# EAGLE design CactusCon7 (EAGLE 9.1.3)
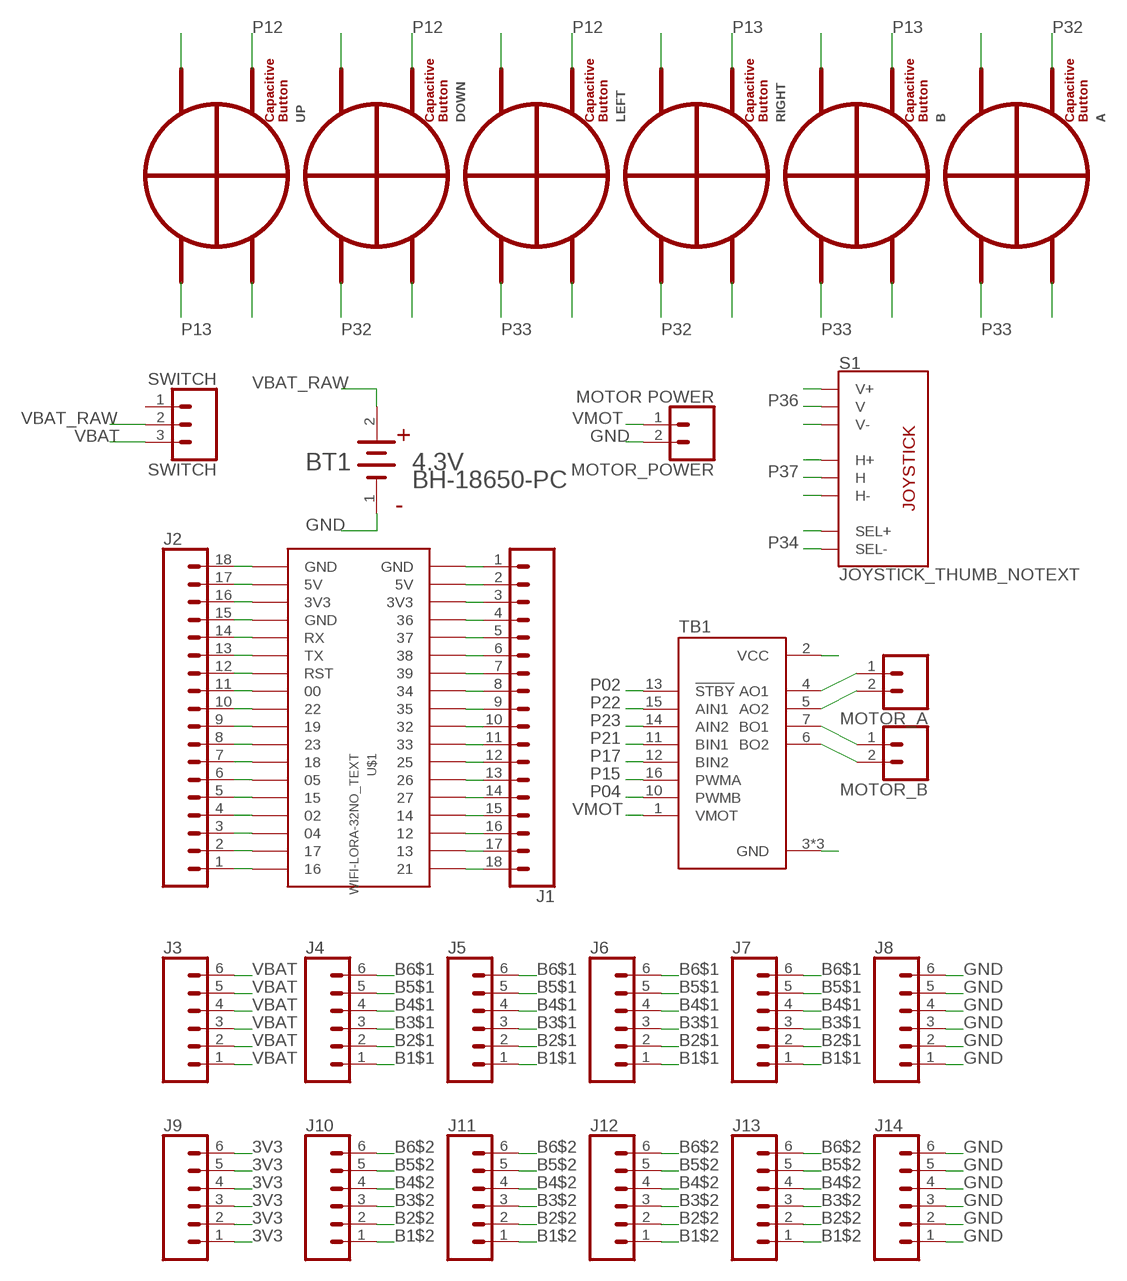
[diagram p0: schematic, sheet 1]

## Parts
A  BUTTON_ACTIVE_QUADNO-LOGO  [BUTTON_ACTIVE_QUAD_10MM_NO_LOGO]
B  BUTTON_ACTIVE_QUADNO-LOGO  [BUTTON_ACTIVE_QUAD_10MM_NO_LOGO]
BT1  MPD_BH-18650-PCMPD_BH-18650-PC_0_0  [MPD_BH-18650-PC_0]
DOWN  BUTTON_ACTIVE_QUADNO-LOGO  [BUTTON_ACTIVE_QUAD_10MM_NO_LOGO]
J1  CONN_18  [1X18]
J2  CONN_18  [1X18]
J3  CONN_06NO_SILK_FEMALE_PTH  [1X06_NO_SILK]
J4  CONN_06NO_SILK_FEMALE_PTH  [1X06_NO_SILK]
J5  CONN_06NO_SILK_FEMALE_PTH  [1X06_NO_SILK]
J6  CONN_06NO_SILK_FEMALE_PTH  [1X06_NO_SILK]
J7  CONN_06NO_SILK_FEMALE_PTH  [1X06_NO_SILK]
J8  CONN_06NO_SILK_FEMALE_PTH  [1X06_NO_SILK]
J9  CONN_06NO_SILK_FEMALE_PTH  [1X06_NO_SILK]
J10  CONN_06NO_SILK_FEMALE_PTH  [1X06_NO_SILK]
J11  CONN_06NO_SILK_FEMALE_PTH  [1X06_NO_SILK]
J12  CONN_06NO_SILK_FEMALE_PTH  [1X06_NO_SILK]
J13  CONN_06NO_SILK_FEMALE_PTH  [1X06_NO_SILK]
J14  CONN_06NO_SILK_FEMALE_PTH  [1X06_NO_SILK]
LEFT  BUTTON_ACTIVE_QUADNO-LOGO  [BUTTON_ACTIVE_QUAD_10MM_NO_LOGO]
MOTOR_A  CONN_02  [1X02]
MOTOR_B  CONN_02  [1X02]
MOTOR_POWER  MOTOR POWER  CONN_02  [1X02]
RIGHT  BUTTON_ACTIVE_QUADNO-LOGO  [BUTTON_ACTIVE_QUAD_10MM_NO_LOGO]
S1  JOYSTICK_THUMB_NOTEXT  [JOYSTICK]
SWITCH  SWITCH  CONN_03  [1X03]
TB1  POLOLU-713ROB-14451  [SHIELD_POLOLU-713]
U$1  WIFI-LORA-32NO_TEXT  [2.54MM_2X18_NO_TEXT]
UP  BUTTON_ACTIVE_QUADNO-LOGO  [BUTTON_ACTIVE_QUAD_10MM_NO_LOGO]

## Nets
3V3 [power]: J1.3 J2.16 J9.1 J9.2 J9.3 J9.4 J9.5 J9.6 S1.B1A(SEL+) S1.H1(H+) S1.V1(V+) TB1.2(VCC) U$1.P$3(3V3) U$1.P$34(3V3)
5V [power]: J1.2 J2.17 U$1.P$2(5V) U$1.P$35(5V)
AO1 [power]: MOTOR_A.1 TB1.4(AO1)
AO2 [power]: MOTOR_A.2 TB1.5(AO2)
B1$1: J4.1 J5.1 J6.1 J7.1
B1$2: J10.1 J11.1 J12.1 J13.1
B2$1: J4.2 J5.2 J6.2 J7.2
B2$2: J10.2 J11.2 J12.2 J13.2
B3$1: J4.3 J5.3 J6.3 J7.3
B3$2: J10.3 J11.3 J12.3 J13.3
B4$1: J4.4 J5.4 J6.4 J7.4
B4$2: J10.4 J11.4 J12.4 J13.4
B5$1: J4.5 J5.5 J6.5 J7.5
B5$2: J10.5 J11.5 J12.5 J13.5
B6$1: J4.6 J5.6 J6.6 J7.6
B6$2: J10.6 J11.6 J12.6 J13.6
BO1 [power]: MOTOR_B.1 TB1.7(BO1)
BO2 [power]: MOTOR_B.2 TB1.6(BO2)
GND [power]: A.Q2 A.Q4 B.Q2 B.Q4 BT1.1(CATHODE) DOWN.Q2 DOWN.Q4 J1.1 J2.15 J2.18 J8.1 J8.2 J8.3 J8.4 J8.5 J8.6 J14.1 J14.2 J14.3 J14.4 J14.5 J14.6 LEFT.Q2 LEFT.Q4 MOTOR_POWER.2 RIGHT.Q2 RIGHT.Q4 S1.H3(H-) S1.V3(V-) TB1.3(GND) TB1.8(GND) TB1.9(GND) U$1.P$1(GND) U$1.P$4(GND) U$1.P$36(GND) UP.Q2 UP.Q4
P00: J2.11 U$1.P$8
P02: J2.4 TB1.13(!STBY) U$1.P$15
P04: J2.3 TB1.10(PWMB) U$1.P$16
P05: J2.6 U$1.P$13
P12 [touch]: DOWN.Q3 J1.16 LEFT.Q3 U$1.P$21 UP.Q3
P13 [touch]: B.Q3 J1.17 RIGHT.Q3 U$1.P$20 UP.Q1
P14: J1.15 U$1.P$22
P15: J2.5 TB1.16(PWMA) U$1.P$14
P16: J2.1 U$1.P$18
P17: J2.2 TB1.12(BIN2) U$1.P$17
P18: J2.7 U$1.P$12
P19: J2.9 U$1.P$10
P21: J1.18 TB1.11(BIN1) U$1.P$19
P22: J2.10 TB1.15(AIN1) U$1.P$9
P23: J2.8 TB1.14(AIN2) U$1.P$11
P25: J1.12 U$1.P$25
P26: J1.13 U$1.P$24
P27: J1.14 U$1.P$23
P32 [touch]: A.Q3 DOWN.Q1 J1.10 RIGHT.Q1 U$1.P$27
P33 [touch]: A.Q1 B.Q1 J1.11 LEFT.Q1 U$1.P$26
P34: J1.8 S1.B2A(SEL-) U$1.P$29
P35: J1.9 U$1.P$28
P36: J1.4 S1.V2(V) U$1.P$33
P37: J1.5 S1.H2(H) U$1.P$32
P38: J1.6 U$1.P$31
P39: J1.7 U$1.P$30
RST: J2.12 U$1.P$7(RST)
RX: J2.14 U$1.P$5(RX)
TX: J2.13 U$1.P$6(TX)
VBAT [power]: J3.1 J3.2 J3.3 J3.4 J3.5 J3.6 SWITCH.3
VBAT_RAW [power]: BT1.2(ANODE) SWITCH.2
VMOT [power]: MOTOR_POWER.1 TB1.1(VMOT)
Unconnected: SWITCH.1

## Library data of the parts
A B DOWN LEFT RIGHT UP = PatternAgents-TouchWidgets:BUTTON_ACTIVE_QUAD: Button, Active Capacitive/Touch Sensing Type, Quad Source : http://www.PatternAgents.com Github : https://github.com/PatternAgents License : http://creativecommons.org/licenses/by-sa/3.1/ (Creative Commons 3.1) THIS SOFTWARE IS PROVIDED BY THE CONTRIBUTORS "AS IS" AND WITHOUT ANY EXPRESS OR IMPLIED WARRANTIES, INCLUDING, BUT NOT LIMITED TO, THE IMPLIED WARRANTIES OF MERCHANTABILITY AND FITNESS FOR A PARTICULAR PURPOSE ARE DISCLAIMED. IN NO EVENT SHALL THE COPYRIGHT OWNER OR CONTRIBUTORS BE LIABLE FOR ANY DIRECT, INDIRECT, INCIDENTAL, SPECIAL, EXEMPLARY, OR CONSEQUENTIAL DAMAGES (INCLUDING, BUT NOT LIMITED TO, PROCUREMENT OF SUBSTITUTE GOODS OR SERVICES; LOSS OF USE, DATA, OR PROFITS; OR BUSINESS INTERRUPTION) HOWEVER CAUSED AND ON ANY THEORY OF LIABILITY, WHETHER IN CONTRACT, STRICT LIABILITY, OR TORT (INCLUDING NEGLIGENCE OR OTHERWISE) ARISING IN ANY WAY OUT OF THE USE OF THIS SOFTWARE, EVEN IF ADVISED OF THE POSSIBILITY OF SUCH DAMAGE.
BT1 = MPD - BH-18650-PC:MPD_BH-18650-PC: Battery Holder 0.839" (21.31mm) Cylindrical Holder.; CENTROID_NOT_SPECIFIED: No; DATASHEET: http://www.memoryprotectiondevices.com/datasheets/BH-18650-PC-datasheet.pdf; DIGIKEY_DESCRIPTION: BATT HOLDER BATT 18650 1CELL PC PIN; DIGIKEY_PART_NUMBER: BH-18650-PC-ND; LEAD_FREE: yes; MF: MPD; MPN: BH-18650-PC; PACKAGE: PTH_BAT; PREFIX: BT; ROHS: yes; TEMPERATURE_RANGE_HIGH: +180°C; TEMPERATURE_RANGE_LOW: -40°C; VOLTAGE: 4.3V
J1 J2 = SparkFun-Connectors:CONN_18: Multi connection point. Often used as Generic Header-pin footprint for 0.1 inch spaced/style header connections On any of the 0.1 inch spaced packages, you can populate with these: Break Away Headers - Straight <https://www.sparkfun.com/products/116> (PRT-00116) Break Away Male Headers - Right Angle <https://www.sparkfun.com/products/553> (PRT-00553) Female Headers <https://www.sparkfun.com/products/115> (PRT-00115) Break Away Headers - Machine Pin <https://www.sparkfun.com/products/117> (PRT-00117) Break Away Female Headers - Swiss Machine Pin <https://www.sparkfun.com/products/743> (PRT-00743) For SCREWTERMINALS and SPRING TERMINALS visit here: Screw Terimnals on SparkFun.com <https://www.sparkfun.com/search/results?term=Screw+Terminals> (5mm/3.5mm/2.54mm spacing) This device is also useful as a general connection point to wire up your design to another part of your project. Our various solder wires solder well into these plated through hole pads. Hook-Up Wire - Assortment (Stranded, 22 AWG) <https://www.sparkfun.com/products/11375> (PRT-11375) Hook-Up Wire - Assortment (Solid Core, 22 AWG) <https://www.sparkfun.com/products/11367> (PRT-11367) View the entire wire category on our website here <https://www.sparkfun.com/categories/141> Special notes: Molex polarized connector foot print use with SKU : PRT-08231 with associated crimp pins and housings. 1MM SMD Version SKU: PRT-10208 NOTES ON THE VARIANTS LOCK and LOCK_LONGPADS... This footprint was designed to help hold the alignment of a through-hole component (i.e. 6-pin header) while soldering it into place. You may notice that each hole has been shifted either up or down by 0.005 of an inch from it's more standard position (which is a perfectly straight line). This slight alteration caused the pins (the squares in the middle) to touch the edges of the holes. Because they are alternating, it causes a "brace" to hold the component in place. 0.005 has proven to be the perfect amount of "off-center" position when using our standard breakaway headers. Although looks a little odd when you look at the bare footprint, once you have a header in there, the alteration is very hard to notice. Also,if you push a header all the way into place, it is covered up entirely on the bottom side.
J3-J14 = SparkFun-Connectors:CONN_06: Multi connection point. Often used as Generic Header-pin footprint for 0.1 inch spaced/style header connections On any of the 0.1 inch spaced packages, you can populate with these: Break Away Headers - Straight <https://www.sparkfun.com/products/116> (PRT-00116) Break Away Male Headers - Right Angle <https://www.sparkfun.com/products/553> (PRT-00553) Female Headers <https://www.sparkfun.com/products/115> (PRT-00115) Break Away Headers - Machine Pin <https://www.sparkfun.com/products/117> (PRT-00117) Break Away Female Headers - Swiss Machine Pin <https://www.sparkfun.com/products/743> (PRT-00743) Arduino Stackable Header - 6 Pin <https://www.sparkfun.com/products/9280> (PRT-09280) For SCREWTERMINALS and SPRING TERMINALS visit here: Screw Terimnals on SparkFun.com <https://www.sparkfun.com/search/results?term=Screw+Terminals> (5mm/3.5mm/2.54mm spacing) This device is also useful as a general connection point to wire up your design to another part of your project. Our various solder wires solder well into these plated through hole pads. Hook-Up Wire - Assortment (Stranded, 22 AWG) <https://www.sparkfun.com/products/11375> (PRT-11375) Hook-Up Wire - Assortment (Solid Core, 22 AWG) <https://www.sparkfun.com/products/11367> (PRT-11367) View the entire wire category on our website here <https://www.sparkfun.com/categories/141>; PROD_ID: CONN-08437
MOTOR_A MOTOR_B MOTOR_POWER = SparkFun-Connectors:CONN_02: Multi connection point. Often used as Generic Header-pin footprint for 0.1 inch spaced/style header connections On any of the 0.1 inch spaced packages, you can populate with these: Break Away Headers - Straight <https://www.sparkfun.com/products/116> (PRT-00116) Break Away Male Headers - Right Angle <https://www.sparkfun.com/products/553> (PRT-00553) Female Headers <https://www.sparkfun.com/products/115> (PRT-00115) Break Away Headers - Machine Pin <https://www.sparkfun.com/products/117> (PRT-00117) Break Away Female Headers - Swiss Machine Pin <https://www.sparkfun.com/products/743> (PRT-00743) For SCREWTERMINALS and SPRING TERMINALS visit here: Screw Terimnals on SparkFun.com <https://www.sparkfun.com/search/results?term=Screw+Terminals> (5mm/3.5mm/2.54mm spacing) This device is also useful as a general connection point to wire up your design to another part of your project. Our various solder wires solder well into these plated through hole pads. Hook-Up Wire - Assortment (Stranded, 22 AWG) <https://www.sparkfun.com/products/11375> (PRT-11375) Hook-Up Wire - Assortment (Solid Core, 22 AWG) <https://www.sparkfun.com/products/11367> (PRT-11367) View the entire wire category on our website here <https://www.sparkfun.com/categories/141> Special notes: Molex polarized connector foot print use with: PRT-08233 with associated crimp pins and housings. 2.54_SCREWTERM for use with PRT-10571. 3.5mm Screw Terminal footprints for PRT-08084 5mm Screw Terminal footprints for use with PRT-08432
S1 = SparkFun-Switches:JOYSTICK_THUMB_NOTEXT: Analog Thumb Joystick This is a joystick very similar to the ‘analog’ joysticks on PS2 (PlayStation 2) controllers. Directional movements are simply two potentiometers - one for each axis. Pots are ~10k each. This joystick also has a select button that is actuated when the joystick is pressed down. SparkFun Products Thumb Joystick <https://www.sparkfun.com/products/9032> (COM-09032) SparkFun Thumb Joystick Breakout <https://www.sparkfun.com/products/9110> (BOB-09110) SparkFun Joystick Shield Kit <https://www.sparkfun.com/products/9760> (DEV-09760); PROD_ID: COMP-09744; SF_SKU: COM-09032
SWITCH = SparkFun-Connectors:CONN_03: Multi connection point. Often used as Generic Header-pin footprint for 0.1 inch spaced/style header connections On any of the 0.1 inch spaced packages, you can populate with these: Break Away Headers - Straight <https://www.sparkfun.com/products/116> (PRT-00116) Break Away Male Headers - Right Angle <https://www.sparkfun.com/products/553> (PRT-00553) Female Headers <https://www.sparkfun.com/products/115> (PRT-00115) Break Away Headers - Machine Pin <https://www.sparkfun.com/products/117> (PRT-00117) Break Away Female Headers - Swiss Machine Pin <https://www.sparkfun.com/products/743> (PRT-00743) Stackable Header - 3 Pin (Female, 0.1") <https://www.sparkfun.com/products/13875> (PRT-13875) For SCREWTERMINALS and SPRING TERMINALS visit here: Screw Terimnals on SparkFun.com <https://www.sparkfun.com/search/results?term=Screw+Terminals> (5mm/3.5mm/2.54mm spacing) This device is also useful as a general connection point to wire up your design to another part of your project. Our various solder wires solder well into these plated through hole pads. Hook-Up Wire - Assortment (Stranded, 22 AWG) <https://www.sparkfun.com/products/11375> (PRT-11375) Hook-Up Wire - Assortment (Solid Core, 22 AWG) <https://www.sparkfun.com/products/11367> (PRT-11367) View the entire wire category on our website here <https://www.sparkfun.com/categories/141> Special notes: Molex polarized connector foot print use with SKU : PRT-08232 with associated crimp pins and housings.
TB1 = POLOLU-713:POLOLU-713: DC-motor driver; IC: TB6612FNG; 100kHz; 1A; Uin mot: 4.5
U$1 = ESP32_modules:WIFI-LORA-32

## Net classes
0 default: width 0.305 mm
1 power: width 0.61 mm
2 touch: width 0.254 mm, clearance 0.305 mm

## Board
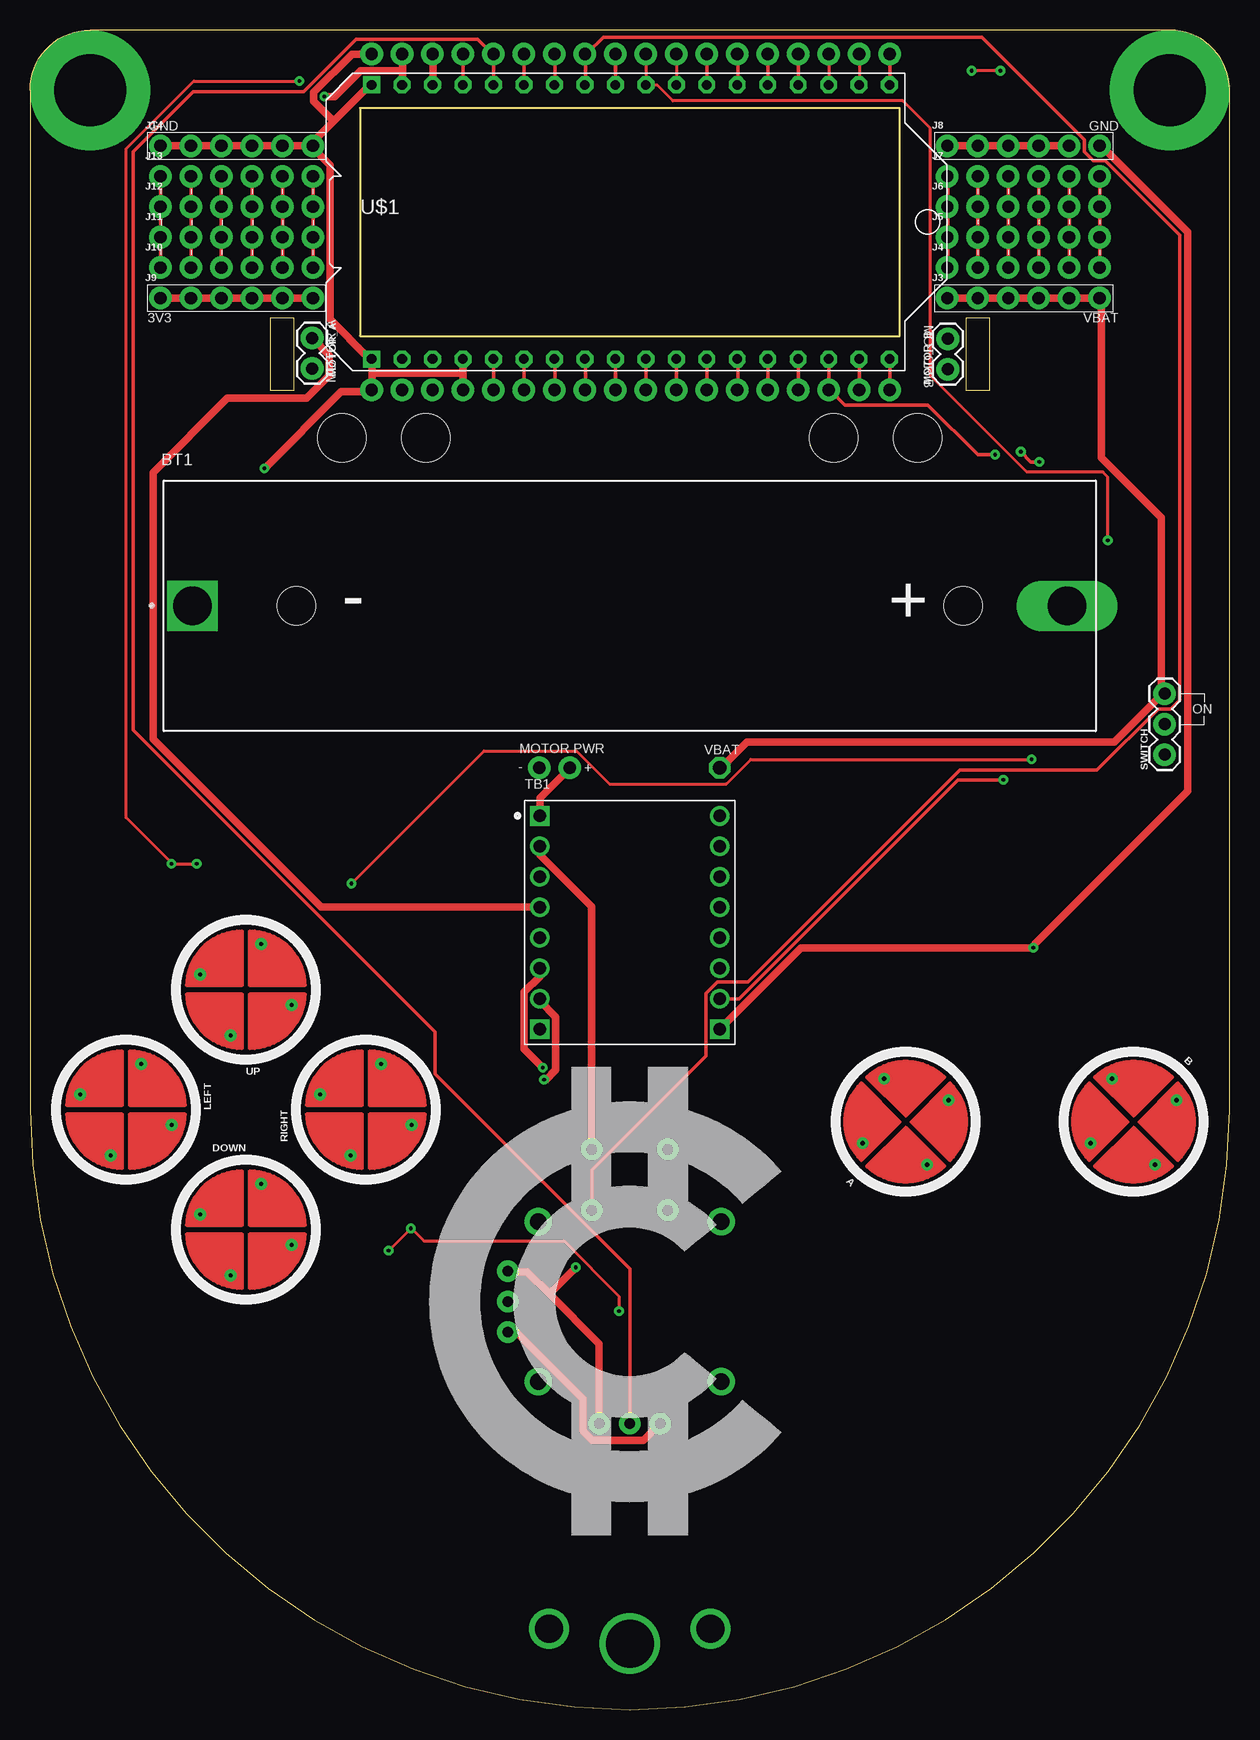
[diagram p1: board, top side]
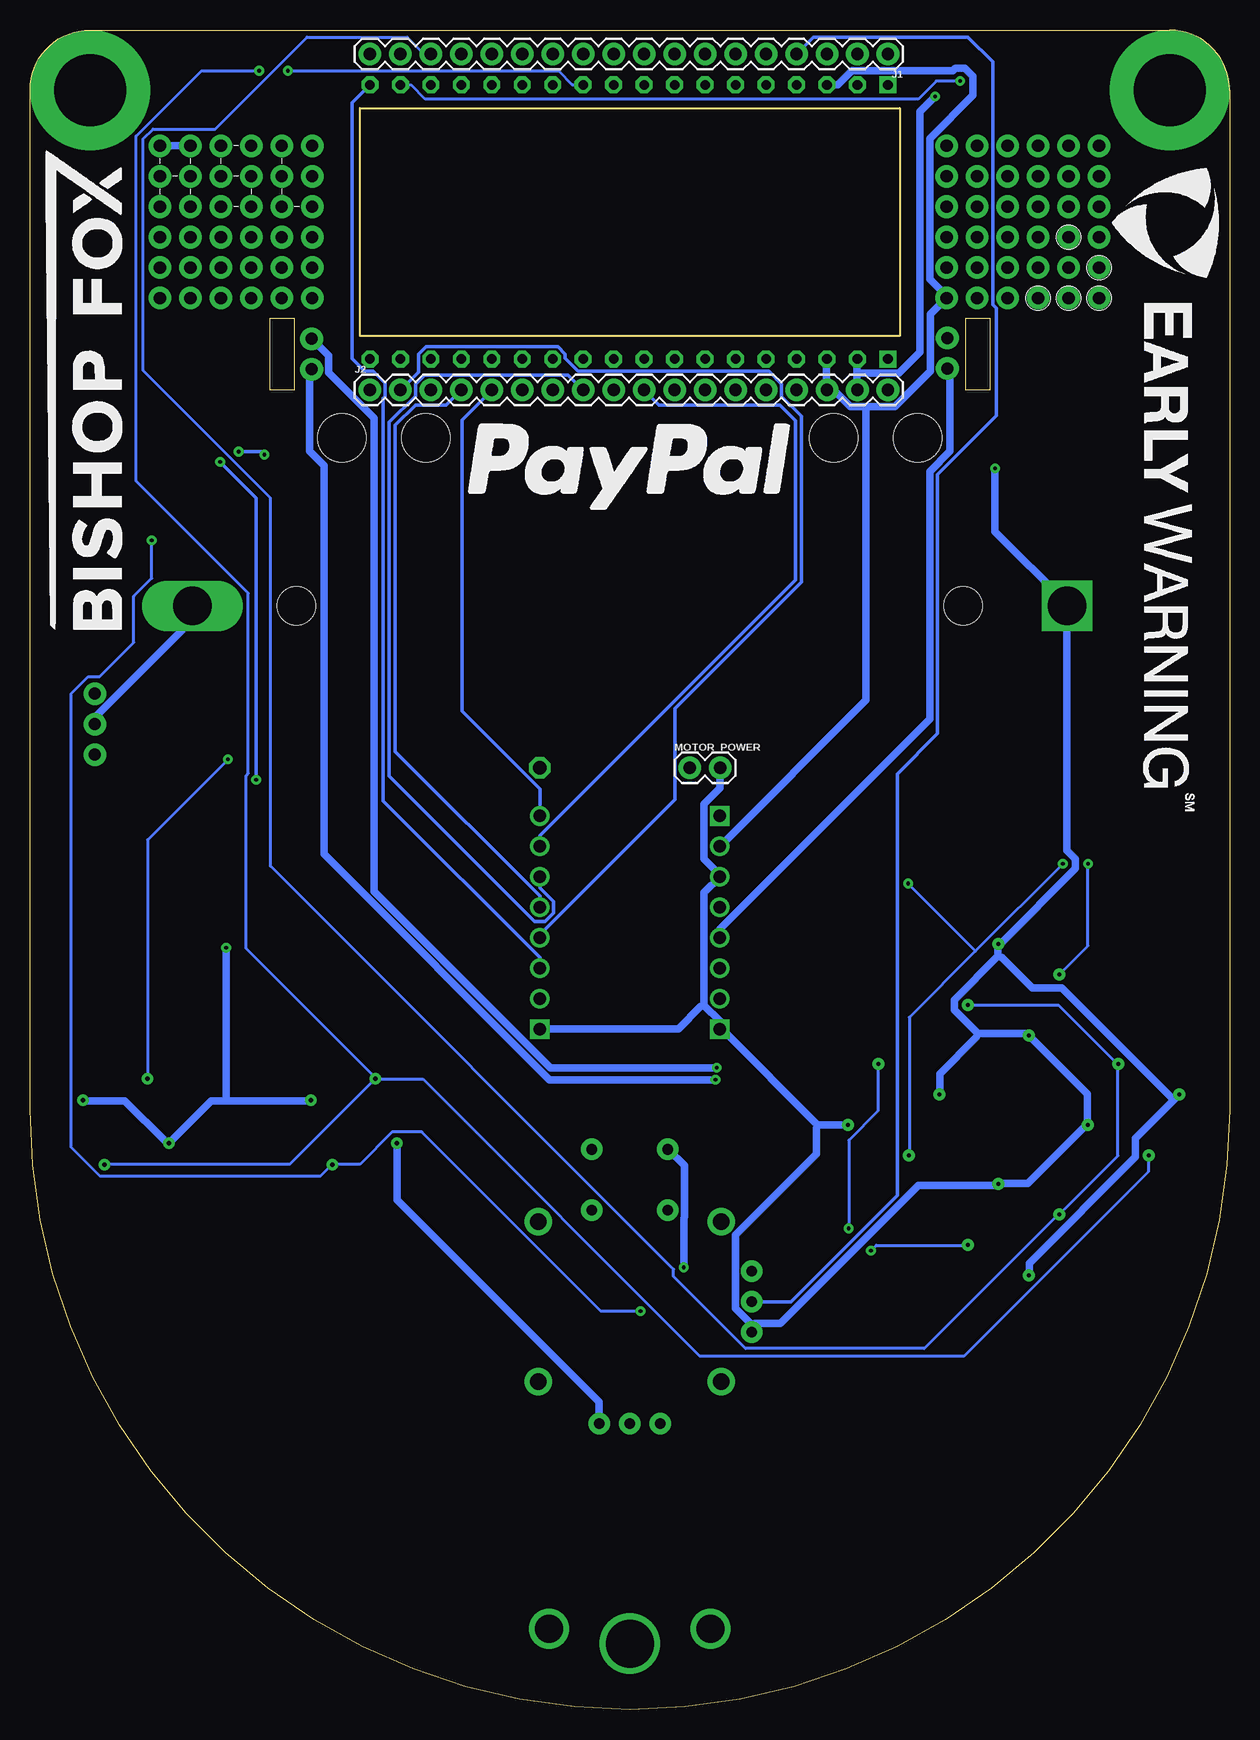
[diagram p2: board, bottom side, seen from below]

Size 100 x 140 mm. Coordinates in mm from the lower left corner, seen from the top.
Outline: 0,135 0,50 arc90 50,0 arc90 100,50 100,135 arc90 95,140 5,140 arc90 0,135
Outline: 20,116 20,110 22,110 22,116 20,116
Outline: 78,116 78,110 80,110 80,116 78,116
Outline: 27.5,133.5 27.5,114.5 72.5,114.5 72.5,133.5 27.5,133.5
Copper layers (1*16): Top 0.035mm / dielectric 1.5mm / Bottom 0.035mm
Design rules "MayhewLabsPCB": minimum track width 6mil, minimum drill 12mil, track to track 6mil, track to pad 6mil, pad to pad 6mil, via to via 6mil, smd to smd 6mil, copper to edge 15mil, drill to drill 6mil, minimum pad ring 12mil, minimum via ring 10mil, stop-mask expansion 4mil, vias tented up to drill 25mil, thermal gap 10mil
Holes 4 mm at 74,106 67,106 33,106 26,106
bRestrict: area 2.5,76 to 8,118; area 91.5,89 to 97.5,129; area 36.4,99.5 to 63.8,107.4; area 0.7,119.1 to 10,128.8; area 2.7,74.7 to 3.9,76.6; area 97.2,89.7 to 99,130.2
vRestrict: area 10.7,81.1 to 89.3,103; area -1,114 to 101,134; area 25,134 to 75,140; area -1,134 to 12,140; area 88,134 to 101,140; area 89,86 to 92,97; area 91,88 to 100,130; area 2.5,74 to 8,118; area 89,71 to 100,88; area 20,103 to 80,114; area 33,17 to 64,54; area -1,28 to 38,81; 4 more areas
Milling: area 27.5,114.5 to 72.5,133.5; area 20,110 to 22,116; area 78,110 to 80,116

### Footprints (pad centres in the part's own frame; a part is rotated, then mirrored left to right if it is on the bottom)
BUTTON_ACTIVE_QUAD_10MM_NO_LOGO = drill 0.356: Q1 -3.81,1.27; Q2 1.27,3.81; Q3 3.81,-1.27; Q4 -1.27,-3.81
MPD_BH-18650-PC_0 = drill 3.2 pad 3.2 square: 1 -36.45,0 | drill 3.2 pad 3.2 long: 2 36.45,0 | hole 3.2: -27.805,0; 27.805,0
1X18 = drill 1.016 pad 1.88: 1 0,0; 2 2.54,0; 3 5.08,0; 4 7.62,0; 5 10.16,0; 6 12.7,0; 7 15.24,0; 8 17.78,0; 9 20.32,0; 10 22.86,0; 11 25.4,0; 12 27.94,0; 13 30.48,0; 14 33.02,0; 15 35.56,0; 16 38.1,0; 17 40.64,0; 18 43.18,0
1X06_NO_SILK = drill 1.016 pad 1.88: 1 0,0; 2 2.54,0; 3 5.08,0; 4 7.62,0; 5 10.16,0; 6 12.7,0
1X02 = drill 1.016 pad 1.88: 1 0,0; 2 2.54,0
JOYSTICK = drill 0.9 pad 1.778: B1A -3.175,12.7; B1B 3.175,12.7; B2A -3.175,7.62; B2B 3.175,7.62 | drill 0.889 pad 1.778: H1 -2.54,-10.16; H2 0,-10.16; H3 2.54,-10.16; V1 -10.16,2.54; V2 -10.16,0; V3 -10.16,-2.54 | drill 1.397 pad 2.286: MOUNT1 -7.62,6.668; MOUNT2 -7.62,-6.668; MOUNT3 7.62,-6.668; MOUNT4 7.62,6.668
1X03 = drill 1.016 pad 1.88: 1 0,0; 2 2.54,0; 3 5.08,0
SHIELD_POLOLU-713 = drill 1.04 square: 1 0,-0.01; 8 0,-17.79; 9 15,-17.79 | drill 1.04: 2 0,-2.55; 3 0,-5.09; 4 0,-7.63; 5 0,-10.17; 6 0,-12.71; 7 0,-15.25; 10 15,-15.25; 11 15,-12.71; 12 15,-10.17; 13 15,-7.63; 14 15,-5.09; 15 15,-2.55; 16 15,-0.01
2.54MM_2X18_NO_TEXT = drill 0.8 square: P$1 -20.32,-11.43; P$36 -20.32,11.43 | drill 0.8 octagon: P$2 -17.78,-11.43; P$3 -15.24,-11.43; P$4 -12.7,-11.43; P$5 -10.16,-11.43; P$6 -7.62,-11.43; P$7 -5.08,-11.43; P$8 -2.54,-11.43; P$9 0,-11.43; P$10 2.54,-11.43; P$11 5.08,-11.43; P$12 7.62,-11.43; P$13 10.16,-11.43; P$14 12.7,-11.43; P$15 15.24,-11.43; P$16 17.78,-11.43; P$17 20.32,-11.43; P$18 22.86,-11.43; P$19 22.86,11.43; P$20 20.32,11.43; P$21 17.78,11.43; P$22 15.24,11.43; P$23 12.7,11.43; P$24 10.16,11.43; P$25 7.62,11.43; P$26 5.08,11.43; P$27 2.54,11.43; P$28 0,11.43; P$29 -2.54,11.43; P$30 -5.08,11.43; P$31 -7.62,11.43; P$32 -10.16,11.43; P$33 -12.7,11.43; P$34 -15.24,11.43; P$35 -17.78,11.43

### Placement (x,y rotation side)
A  73,49 315 top
B  92,49 135 top
BT1  50,92 0 top
DOWN  18,40 180 top
J1  28.48,138 180 bottom
J2  71.66,110 0 bottom
J3  76.47,117.65 0 top
J4  76.47,120.19 0 top
J5  76.47,122.73 0 top
J6  76.47,125.27 0 top
J7  76.47,127.81 0 top
J8  76.47,130.35 0 top
J9  10.88,117.65 0 top
J10  10.88,120.19 0 top
J11  10.88,122.73 0 top
J12  10.88,125.27 0 top
J13  10.88,127.81 0 top
J14  10.88,130.35 0 top
LEFT  8,50 90 top
MOTOR_A  23.52,114.32 270 top
MOTOR_B  76.52,111.72 90 top
MOTOR_POWER  45,78.5 0 bottom
RIGHT  28,50 270 top
S1  50,34 0 top
SWITCH  94.6,79.6 90 top
TB1  42.5,74.5 0 top
U$1  48.8,124 0 top
UP  18,60 0 top

### Tracks (layer width: path | path; a pad name or v marks a point on that pad's centre or on a via)
3V3  (via drill 0.3)
  Top 0.61: U$1.P$34 33.6,135.45 33.6,138 J1.3 | J9.1 J9.2 J9.3 J9.4 J9.5 J9.6 | 43.3,34.65 47.45,30.5 S1.H1 | 43.3,34.65 41.45,36.5 39.85,36.5 S1.V1 | TB1.2 42.5,71.25 46.8,66.95 46.8,46.7 S1.B1A | v45.5,36.85 43.3,34.65
  Bottom 0.61: U$1.P$3 33.6,112.55 33.6,110 J2.16 33.3,109.85 32.85,109.85 31.6,108.6 30.3,108.6 | 30.3,108.6 27.9,108.6 24.95,111.55 24.95,116.3 23.6,117.65 J9.6 23.7,117.95 25,119.25 25,130.95 21.4,134.55 21.4,136.15 22.05,136.8 22.85,136.8 23.05,136.6 31.5,136.6 32.65,135.45 33.55,135.45 U$1.P$34 | v45.5,36.85 45.5,41 45.45,41.05 45.45,45.35 46.8,46.7 S1.B1A | 30.3,108.6 30.3,84.15 TB1.2
5V  (via drill 0.3)
  Top 0.61: 31.05,136.6 31.05,138 J1.2 | 31.05,136.6 31.05,135.45 U$1.P$35 | v24.55,134.45 25.4,134.45 27.55,136.6 31.05,136.6
  Bottom 0.61: 31.05,111.4 31.05,110 J2.17 | 31.05,111.4 31.05,112.55 U$1.P$2 | 31.05,111.4 27.55,111.4 25.8,113.15 25.8,133.2 v24.55,134.45
AO1
  Top 0.61: TB1.4 42.5,66.9 24.25,66.9 10.25,80.9 10.25,103.1 16.45,109.3 23.05,109.3 24.95,111.2 24.95,112.9 23.55,114.3 MOTOR_A.1
AO2
  Bottom 0.61: TB1.5 42.5,65.05 25,82.55 25,103.2 23.3,104.9 23.3,111.55 23.5,111.75 MOTOR_A.2
B1$1
  Top 0.305: J4.1 76.5,120.2 76.5,122.7 J5.1 76.5,122.85 76.5,125.25 J6.1 76.5,125.4 76.5,127.8 J7.1
B1$2
  Top 0.305: J10.1 10.9,120.2 10.9,122.7 J11.1 10.9,122.85 10.9,125.25 J12.1 10.9,125.4 10.9,127.8 J13.1
B2$1
  Top 0.305: J4.2 79,122.7 J5.2 79,122.85 79,125.25 J6.2 79,125.4 J7.2
B2$2
  Top 0.305: J10.2 13.45,120.2 13.45,122.7 J11.2 13.45,122.85 13.45,125.25 J12.2 13.45,125.4 13.45,127.8 J13.2
B3$1
  Top 0.305: J4.3 J5.3 J6.3 J7.3
B3$2
  Top 0.305: J10.3 15.95,122.7 J11.3 15.95,122.85 15.95,125.25 J12.3 15.95,125.4 J13.3
B4$1
  Top 0.305: J4.4 84.1,122.7 J5.4 84.1,122.85 84.1,125.25 J6.4 84.1,125.4 J7.4
B4$2
  Top 0.305: J10.4 J11.4 J12.4 J13.4
B5$1
  Top 0.305: J4.5 86.65,120.2 86.65,122.7 J5.5 86.65,122.85 86.65,125.25 J6.5 86.65,125.4 86.65,127.8 J7.5
B5$2
  Top 0.305: J10.5 21.05,122.7 J11.5 21.05,122.85 21.05,125.25 J12.5 21.05,125.4 J13.5
B6$1
  Top 0.305: J4.6 89.2,120.2 89.2,122.7 J5.6 89.2,122.85 89.2,125.25 J6.6 89.2,125.4 89.2,127.8 J7.6
B6$2
  Top 0.305: J10.6 23.6,120.2 23.6,122.7 J11.6 23.6,122.85 23.6,125.25 J12.6 23.6,125.4 23.6,127.8 J13.6
BO1  (via drill 0.3)
  Top 0.61: TB1.7 42.5,59.05 43.8,57.75 43.8,53.3 43,52.5 v42.85,52.5
  Bottom 0.61: v42.85,52.5 56.7,52.5 75.5,71.3 75.5,103.7 76.7,104.9 76.7,111.55 76.55,111.7 MOTOR_B.1
BO2  (via drill 0.3)
  Top 0.61: TB1.6 42.5,61.1 41.2,59.8 41.2,55.05 v42.75,53.5
  Bottom 0.61: v42.75,53.5 56.6,53.5 71.3,68.2 71.3,107.65 75.1,111.45 75.1,112.85 76.5,114.25 MOTOR_B.2
GND  (via drill 0.3)
  Top 0.61: J14.1 J14.2 J14.3 J14.4 J14.5 J14.6 | 28.5,111.4 28.5,110 J2.18 28.2,109.85 25.95,109.85 v19.55,103.45 | 28.5,111.4 28.5,112.55 U$1.P$1 28.2,112.7 25,115.9 25,128.75 23.7,130.05 J14.6 | J2.15 36.1,111.4 | 36.1,111.4 U$1.P$4 | 36.1,111.4 28.5,111.4 | 25.3,132.4 23.6,130.7 23.6,130.35 J14.6 | 25.3,132.4 28.3,135.4 28.45,135.4 U$1.P$36 | J1.1 26.85,138 23.65,134.8 23.65,134.05 25.3,132.4 | S1.H3 51.15,22.45 46.9,22.45 46.1,23.25 46.1,25.9 40.55,31.45 S1.V3 | J8.1 J8.2 J8.3 J8.4 J8.5 | TB1.9 57.5,56.75 64.25,63.5 v83.65,63.5 83.75,63.8 96.5,76.55 96.5,123.15 89.3,130.35 J8.6
  Bottom 0.61: 4.65,50.8 4.2,51.25 LEFT.Q2 | 4.65,50.8 7.85,47.6 7.85,46.05 16.7,37.2 16.7,36.2 DOWN.Q2 | 19.3,62.8 19.3,63.8 UP.Q2 19,63.95 12.85,70.1 12.85,70.9 13.55,71.6 BT1.1 13.65,92.3 19.55,98.2 v19.55,103.45 | 19.3,62.8 22.95,59.15 22.95,58.3 21,56.35 | 21,56.35 17,56.35 UP.Q4 16.7,56.15 11.85,51.3 11.85,48.75 LEFT.Q4 12.1,48.55 16.8,43.85 19.25,43.85 DOWN.Q4 19.55,43.7 25.95,43.7 37.45,32.2 39.55,32.2 S1.V3 39.85,31.5 39.85,32.1 41.2,33.45 41.2,39.55 34.45,46.3 34.45,48.45 34.35,48.75 | RIGHT.Q4 24.15,51.3 24.15,53 21.1,56.05 21,56.35 | 4.65,50.8 14,60.15 16.45,60.15 19,62.7 19.3,62.8 | A.Q4 69.4,42.5 52.55,25.65 S1.H3 | J8.5 J8.6 | 83.65,50.75 84.9,50.75 88.4,47.25 B.Q2 88.7,47.35 92.1,50.75 95.55,50.75 B.Q4 | 83.65,50.75 76.6,50.75 A.Q2 | 43.8,58.7 42.5,57.4 TB1.8 42.2,56.6 34.35,48.75 | 43.8,58.7 43.8,68.1 TB1.3 42.6,69.7 43.8,70.9 43.8,75.5 42.5,76.8 42.5,78.5 MOTOR_POWER.2 | TB1.9 57.5,56.75 45.95,56.75 44.1,58.6 43.8,58.7 | 34.35,48.75 31.85,48.75 RIGHT.Q2 | v83.65,63.5 83.65,50.75
N$1  (via drill 6 pad 10)
  other vias: 5,135
N$2  (via drill 6 pad 10)
  other vias: 95,135
N$3  (via drill 2.35 pad 3.35)
  other vias: 56.73,6.73
N$4  (via drill 2.35 pad 3.35)
  other vias: 43.27,6.73
N$5  (via drill 4 pad 5)
  other vias: 50,5.5
P00
  Top 0.305: U$1.P$8 46.3,112.55 46.3,110 J2.11
P02
  Top 0.305: U$1.P$15 64.05,112.55 J2.4
  Bottom 0.305: TB1.13 57.5,67.8 69.55,79.85 69.55,107.05 67.85,108.75 65.3,108.75 J2.4
P04  (via drill 0.3)
  Top 0.305: U$1.P$16 66.6,112.55 66.6,110 J2.3 66.75,109.95 67.95,108.75 74.85,108.75 79,104.6 v80.45,104.6 | TB1.10 59.1,59.25 77.35,77.5 v81.15,77.5 | v84.15,104 83.45,104 v82.6,104.85
  Bottom 0.305: v81.15,77.5 81.15,101 v84.15,104 | v82.6,104.85 80.7,104.85 v80.45,104.6
P05
  Top 0.305: U$1.P$13 59,112.55 59,110 J2.6
P12
  Top 0.254: U$1.P$21 66.6,135.45 66.6,138 J1.16
  Bottom 0.254: UP.Q3 21.8,58.7 14.25,58.7 9.4,53.85 LEFT.Q3 9.3,53.8 9.3,46.15 14.15,41.3 DOWN.Q3 14.3,41.25 25.45,30.1 40.35,30.1 46.35,36.1 46.35,36.7 79.95,70.3 79.95,101 90.55,111.6 90.55,130.95 89.75,131.75 84.55,131.75 76.9,139.4 68.55,139.4 67.15,138 J1.16
P13  (via drill 0.3)
  Top 0.254: U$1.P$20 69.15,135.45 69.15,138 J1.17 | v13.9,70.5 v11.8,70.5 11.75,70.6 8,74.35 8,130.1 13.65,135.75 v22.45,135.75 | v83.5,79.2 60.1,79.2 58.05,77.15 48.3,77.15 45.55,79.9 37.85,79.9 v26.8,68.85
  Bottom 0.254: v13.9,70.5 21.18,63.23 | 21.18,63.23 26.7,57.7 26.7,46.2 RIGHT.Q3 | v11.8,70.5 11.8,63.65 14.15,61.3 UP.Q1 | v83.5,79.2 90.2,72.5 B.Q3 | 21.18,63.23 v26.8,68.85 | v22.45,135.75 24.45,135.75 25.95,134.25 67.05,134.25 68.2,135.4 69.1,135.4 U$1.P$20
P14
  Top 0.305: U$1.P$22 64.05,135.45 J1.15
P15
  Top 0.305: J2.5 U$1.P$14
  Bottom 0.305: TB1.16 57.5,76.75 64,83.25 64,107.5 J2.5
P16
  Top 0.305: U$1.P$18 71.7,112.55 71.7,110 J2.1
P17
  Top 0.305: U$1.P$17 69.15,112.55 69.15,110 J2.2
  Bottom 0.305: TB1.12 57.5,64.6 46.25,75.85 46.25,83.45 35.7,94 35.7,107.8 37.35,109.45 37.35,110.5 38.4,111.55 54.3,111.55 55.4,112.65 55.4,113 56,113.6 67,113.6 67.6,113 67.6,111.5 69.1,110 J2.2
P18
  Top 0.305: U$1.P$12 56.45,112.55 56.45,110 J2.7
P19
  Top 0.305: U$1.P$10 51.35,112.55 J2.9
P21
  Top 0.305: U$1.P$19 71.7,135.45 71.7,138 J1.18
  Bottom 0.305: TB1.11 57.5,62.7 70.55,75.75 70.55,109.3 70.4,109.45 70.4,110.55 71.4,111.55 72.1,111.55 73.15,112.6 73.15,133.95 71.7,135.4 U$1.P$19
P22
  Top 0.305: J2.10 U$1.P$9
  Bottom 0.305: TB1.15 57.5,72.85 36.2,94.15 36.2,107.45 37.5,108.75 47.55,108.75 J2.10
P23
  Top 0.305: U$1.P$11 53.9,112.55 53.9,110 J2.8
  Bottom 0.305: TB1.14 57.5,68.5 56.35,67.35 56.35,66.4 57.05,65.7 57.95,65.7 70.05,77.8 70.05,107.3 67.85,109.5 67.85,110.5 67.1,111.25 55.15,111.25 53.9,110 J2.8
P25
  Top 0.305: U$1.P$25 56.45,135.45 56.45,138 J1.12
P26
  Top 0.305: U$1.P$24 59,135.45 59,138 J1.13
P27
  Top 0.305: J1.14 U$1.P$23
P32  (via drill 0.3)
  Top 0.254: J1.10 51.35,135.45 U$1.P$27 51.45,135.4 52.3,135.4 53.6,134.1 72.75,134.1 75.05,131.8 75.05,111.2 83.1,103.15 89.45,103.15 89.85,102.75 v89.85,97.45 | v29.9,38.25 v31.75,40.1 31.85,40.05 32.85,39.05 44.5,39.05 49.1,34.45 v49.1,33.2
  Bottom 0.254: v29.9,38.25 29.45,38.7 21.85,38.7 DOWN.Q1 | v31.75,40.1 31.75,47.45 29.3,49.9 29.3,53.8 RIGHT.Q1 | v49.1,33.2 52.4,33.2 67.35,48.15 69.8,48.15 72.5,45.45 74.75,45.45 A.Q3 74.9,45.35 75.8,44.45 94.15,44.45 96.55,46.85 96.55,84.7 95.15,86.1 94.2,86.1 91.35,88.95 91.35,92.8 89.85,94.3 v89.85,97.45
P33  (via drill 0.3)
  Top 0.254: U$1.P$26 53.9,135.45 53.9,138 J1.11 | v80.9,136.6 v78.5,136.6
  Bottom 0.254: LEFT.Q1 6.75,46.15 6.75,44.85 22.1,29.5 44.2,29.5 67.25,52.55 71.2,52.55 A.Q1 | B.Q1 93.75,45.45 78.35,45.45 71.3,52.5 A.Q1 | v78.5,136.6 55.95,136.6 54.8,135.45 53.9,135.45 U$1.P$26 | v80.9,136.6 85.7,136.6 91.15,131.15 91.15,102.4 81.8,93.05 81.8,78.05 82,77.85 82,63.45 71.25,52.7 A.Q1
P34
  Top 0.305: U$1.P$29 46.3,135.45 46.3,138 J1.8 46.45,138.05 47.8,139.4 79.35,139.4 87.9,130.85 87.9,129.85 88.65,129.1 89.65,129.1 95.85,122.9 95.85,84.15 95.1,83.4 94.05,83.4 88.95,78.3 77.5,78.3 59.85,60.65 57.3,60.65 56.35,59.7 56.35,54.5 46.85,45 46.85,41.65 S1.B2A
P35
  Top 0.305: J1.9 U$1.P$28
P36
  Top 0.305: J1.4 U$1.P$33
  Bottom 0.305: S1.V2 36.55,34 27.7,42.85 27.7,78 24.35,81.35 24.35,102.95 19.45,107.85 19.45,116.8 19.75,117.1 19.75,137.35 21.8,139.4 34.7,139.4 J1.4
P37
  Top 0.305: U$1.P$32 38.65,135.45 J1.5 38.5,138.05 37.3,139.25 27.2,139.25 22.8,134.85 13.6,134.85 8.6,129.85 8.6,81.65 33.75,56.5 33.75,53 50,36.75 S1.H2
P38
  Top 0.305: U$1.P$31 41.2,135.45 41.2,138 J1.6
P39
  Top 0.305: U$1.P$30 43.75,135.45 43.75,138 J1.7
RST
  Top 0.305: U$1.P$7 43.75,112.55 43.75,110 J2.12
RX
  Top 0.305: U$1.P$5 38.65,112.55 J2.14
TX
  Top 0.305: U$1.P$6 41.2,112.55 41.2,110 J2.13
VBAT  (via drill 1.1 pad 1.8)
  Top 0.61: J3.1 J3.2 J3.3 J3.4 J3.5 J3.6 89.3,117.35 89.3,104.35 94.3,99.35 94.3,84.95 SWITCH.3 94.6,84.65 94.4,84.65 90.4,80.65 59.75,80.65 57.6,78.5 v57.5,78.5
VBAT_RAW
  Bottom 0.61: SWITCH.2 94.6,82.7 86.45,90.85 BT1.2
VMOT
  Top 0.61: TB1.1 42.5,76 MOTOR_POWER.1

### Text on the board
tDocu: GND | 5V | 3V3 | 36 | 37 | 38 | 39 | 34 | 35 | 32 | 33 | 25 | 26 | 27 | 14 | 12 | 13 | 21 | GND | 5V | 3V3 | GND | RX | TX | RST | 00 | 22 | 19 | 23 | 18 | 05 | 15 | 02 | 04 | 17 | 16
_tsilk: GND | GND | 3V3 | VBAT | MOTOR B | MOTOR A | - | ON | MOTOR PWR | VBAT | - | +